# EAGLE design controller_ardu (EAGLE 7.2.0)
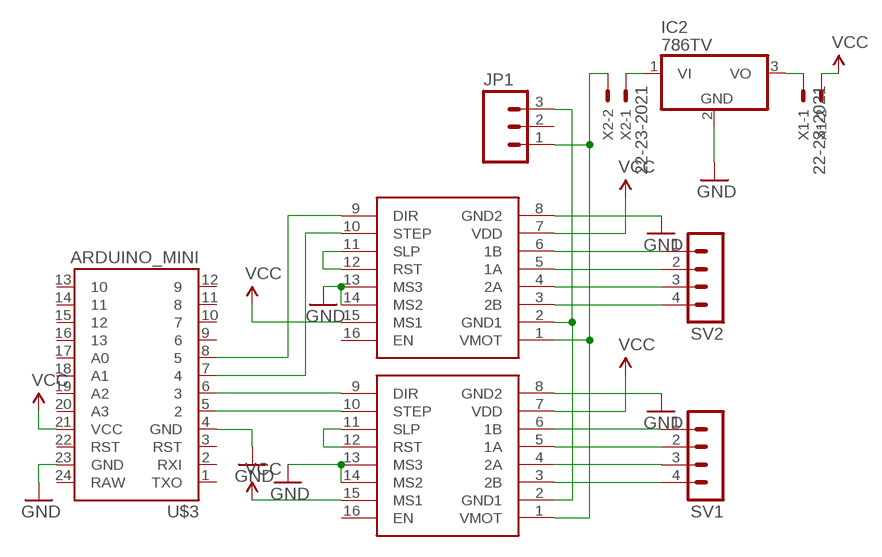
[diagram p0: schematic, sheet 1]

## Parts
IC2  786TV  [TO220V]
JP1  M03SCREW  [SCREWTERMINAL-3.5MM-3]
SV1  MA04-1  [MA04-1]
SV2  MA04-1  [MA04-1]
U$1  POLOLUESTEPPERDRIVER  [DIL16]
U$2  POLOLUESTEPPERDRIVER  [DIL16]
U$3  ARDUINO_MINI  [ARDUINO_MINI]
X1  22-23-2021  [22-23-2021]
X2  22-23-2021  [22-23-2021]

## Nets
GND: IC2.2(GND) U$1.8(GND2) U$1.13(MS3) U$1.14(MS2) U$2.8(GND2) U$2.13(MS3) U$2.14(MS2) U$3.4(GND) U$3.23(GND)
N$1: SV2.1 U$2.6(1B)
N$2: SV2.2 U$2.5(1A)
N$3: SV2.3 U$2.4(2A)
N$4: SV2.4 U$2.3(2B)
N$5: U$2.10(STEP) U$3.7
N$6: U$2.9(DIR) U$3.8
N$7: U$2.11(SLP) U$2.12(RST)
N$9: SV1.1 U$1.6(1B)
N$10: SV1.2 U$1.5(1A)
N$11: SV1.3 U$1.4(2A)
N$12: SV1.4 U$1.3(2B)
N$13: U$1.9(DIR) U$3.6
N$14: U$1.10(STEP) U$3.5
N$15: U$1.11(SLP) U$1.12(RST)
N$17: JP1.3 U$1.2(GND1) U$2.2(GND1)
N$18: JP1.1 U$1.1(VMOT) U$2.1(VMOT) X2.2
N$19: IC2.3(VO) X1.1
N$20: IC2.1(VI) X2.1
VCC: U$1.7(VDD) U$1.15(MS1) U$2.7(VDD) U$2.15(MS1) U$3.21(VCC) X1.2
Unconnected: JP1.2 U$1.16(EN) U$2.16(EN) U$3.1(TXO) U$3.2(RXI) U$3.3(RST) U$3.9 U$3.10 U$3.11 U$3.12 U$3.13 U$3.14 U$3.15 U$3.16 U$3.17(A0) U$3.18(A1) U$3.19(A2) U$3.20(A3) U$3.22(RST) U$3.24(RAW)

## Library data of the parts
IC2 = linear:78*: Positive VOLTAGE REGULATOR Source: http://cache.national.com/ds/LM/LM78L05.pdf http://www.fairchildsemi.com/ds/LM/LM7805.pdf
JP1 = SparkFun-Connectors:M03: Header 3 Standard 3-pin 0.1" header. Use with straight break away headers (SKU : PRT-00116), right angle break away headers (PRT-00553), swiss pins (PRT-00743), machine pins (PRT-00117), and female headers (PRT-00115). Molex polarized connector foot print use with SKU : PRT-08232 with associated crimp pins and housings.
SV1 SV2 = con-lstb:MA04-1: PIN HEADER; OC_FARNELL: unknown; OC_NEWARK: unknown
U$1 U$2 = reprap:POLOLUESTEPPERDRIVER: Pololu stepper driver based on the A4983.
U$3 = SparkFun-Boards:ARDUINO_MINI: Arduino Pro Mini footprint
X1 X2 = con-molex:22-23-2021: .100" (2.54mm) Center Header - 2 Pin; MF: MOLEX; MPN: 22-23-2021; OC_FARNELL: 1462926; OC_NEWARK: 25C3832

## Board
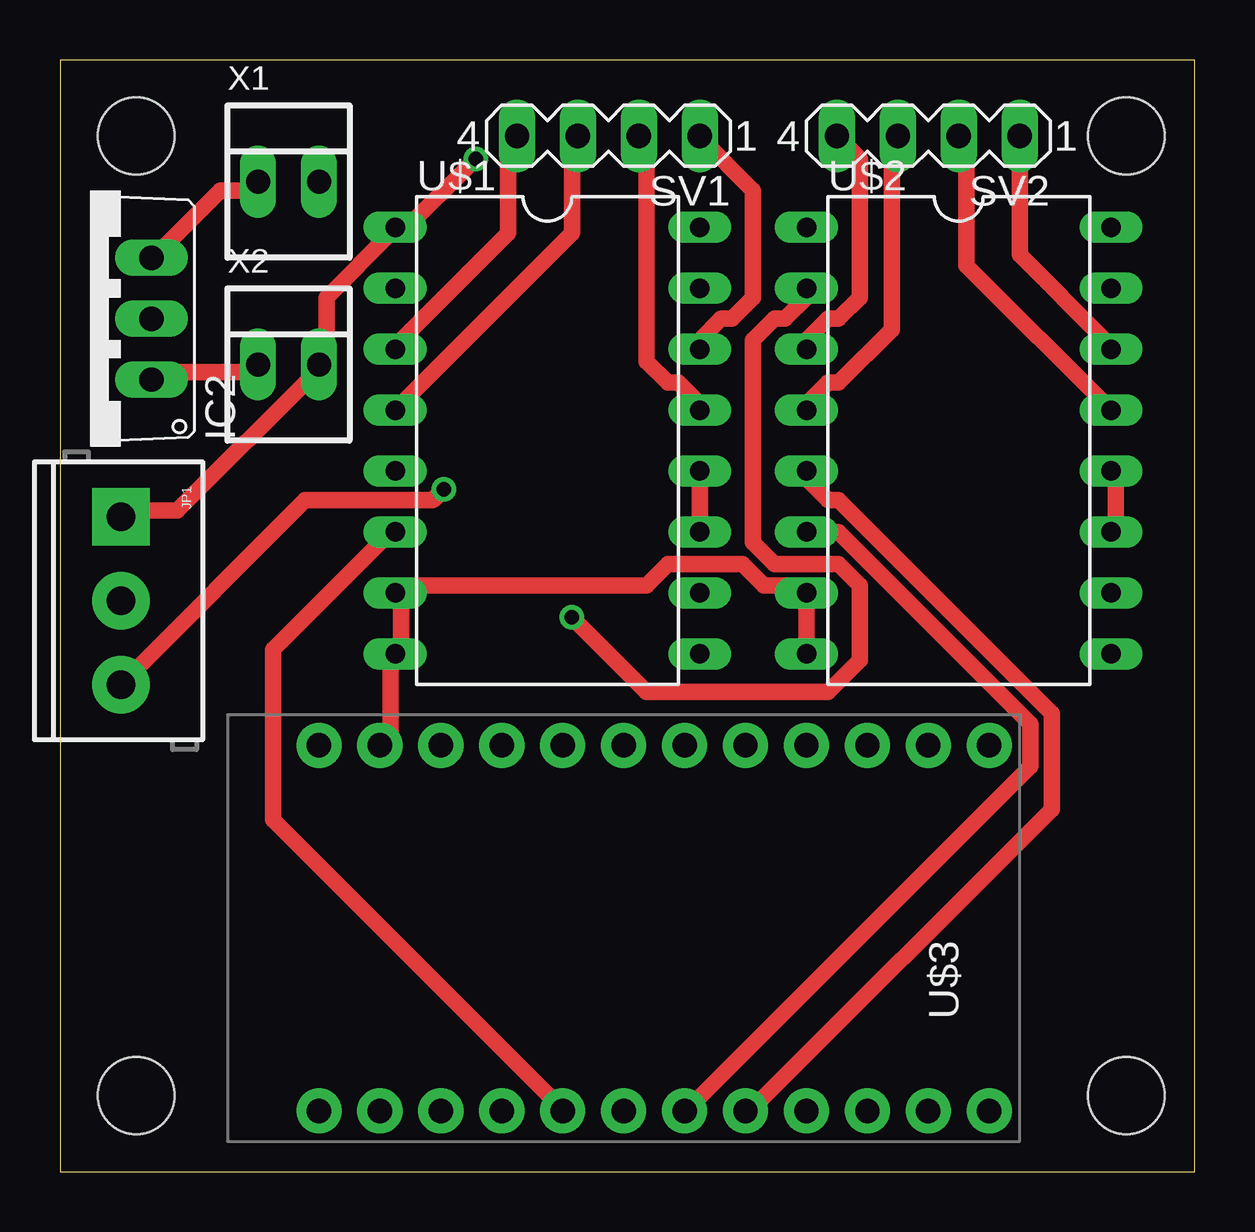
[diagram p1: board, top side]
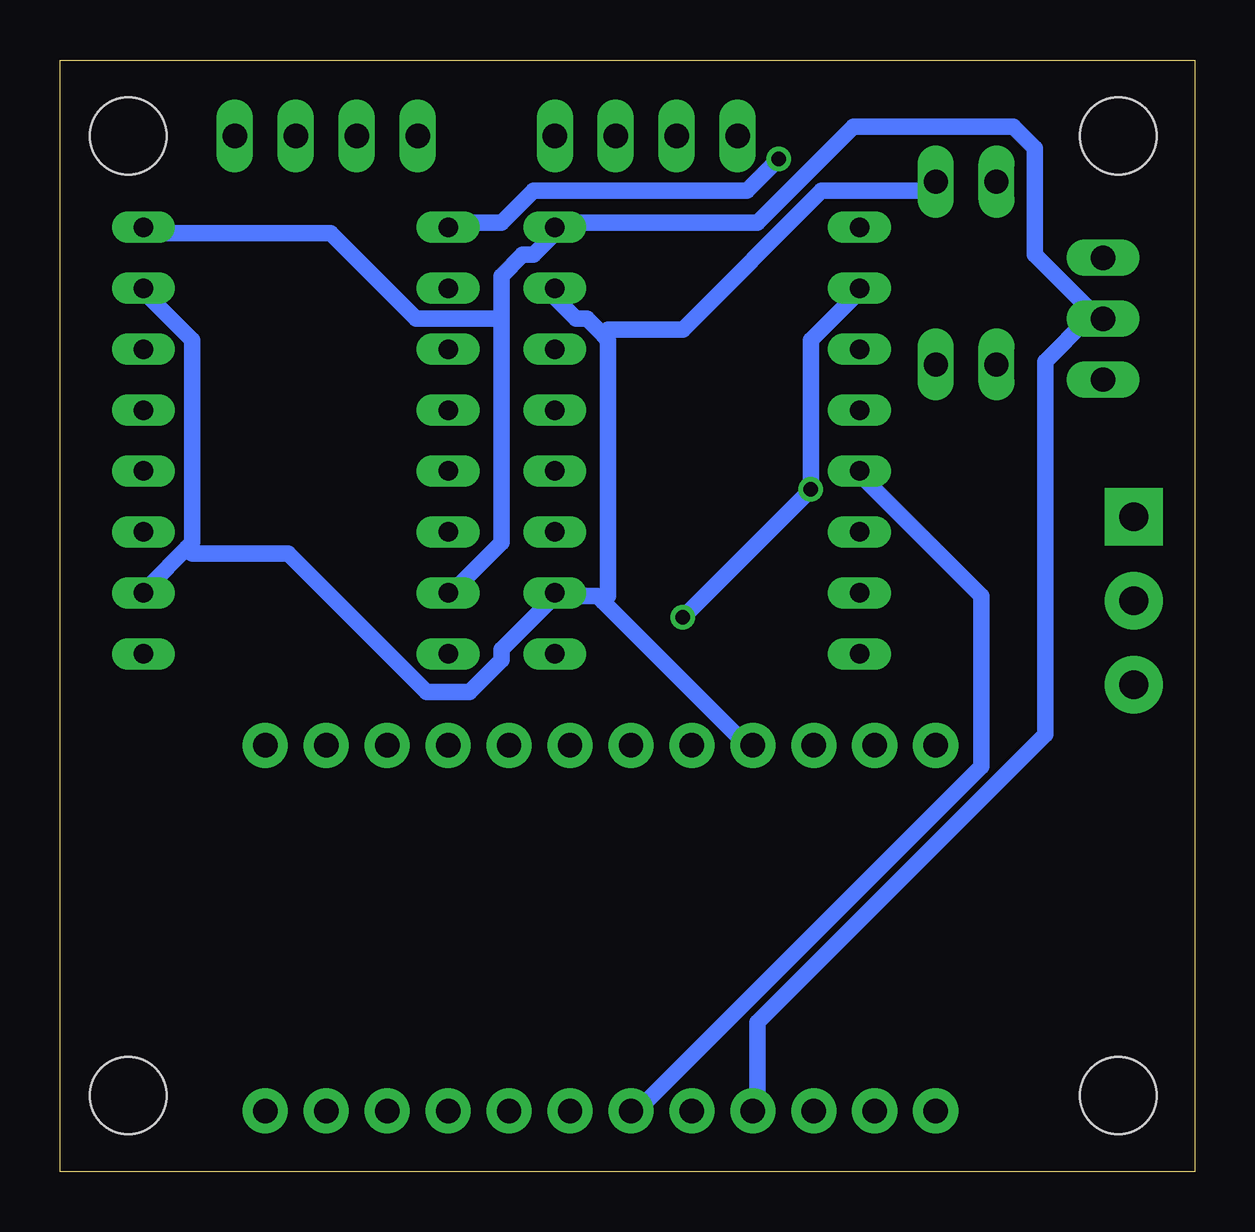
[diagram p2: board, bottom side, seen from below]

Size 47.3 x 46.34 mm. Coordinates in mm from the lower left corner, seen from the top.
Outline: 0,0 47.3,0 47.3,46.34 0,46.34 0,0
Copper layers (1*16): Top 0.035mm / dielectric 1.5mm / Bottom 0.035mm
Design rules "default *": minimum track width 27mil, minimum drill 24mil, track to track 8mil, track to pad 8mil, pad to pad 8mil, via to via 8mil, smd to smd 8mil, copper to edge 40mil, drill to drill 8mil, minimum pad ring 10mil, minimum via ring 8mil, stop-mask expansion 4mil, vias tented up to drill 0mil, thermal gap 10mil
Holes 3.2 mm at 3.17,43.18 44.45,43.18 44.45,3.17 3.17,3.17

### Footprints (pad centres in the part's own frame; a part is rotated, then mirrored left to right if it is on the bottom)
TO220V = drill 1.016 long: 1 -2.54,-2.54; 2 0,-2.54; 3 2.54,-2.54
SCREWTERMINAL-3.5MM-3 = drill 1.2 pad 2.413 square: 1 0,0 | drill 1.2 pad 2.413: 2 3.5,0; 3 7,0
MA04-1 = drill 1.016 long: 1 -3.81,0; 2 -1.27,0; 3 1.27,0; 4 3.81,0
DIL16 = drill 0.813 long: 1 -17.78,8.89; 2 -17.78,6.35; 3 -17.78,3.81; 4 -17.78,1.27; 5 -5.08,1.27; 6 -5.08,3.81; 7 -5.08,6.35; 8 -5.08,8.89; 9 -17.78,-1.27; 10 -17.78,-3.81; 11 -5.08,-3.81; 12 -5.08,-1.27; 13 -17.78,-6.35; 14 -17.78,-8.89; 15 -5.08,-6.35; 16 -5.08,-8.89
ARDUINO_MINI = drill 1.016 pad 1.88: 1 -7.62,12.7; 2 -7.62,10.16; 3 -7.62,7.62; 4 -7.62,5.08; 5 -7.62,2.54; 6 -7.62,0; 7 -7.62,-2.54; 8 -7.62,-5.08; 9 -7.62,-7.62; 10 -7.62,-10.16; 11 -7.62,-12.7; 12 -7.62,-15.24; 13 7.62,-15.24; 14 7.62,-12.7; 15 7.62,-10.16; 16 7.62,-7.62; 17 7.62,-5.08; 18 7.62,-2.54; 19 7.62,0; 20 7.62,2.54; 21 7.62,5.08; 22 7.62,7.62; 23 7.62,10.16; 24 7.62,12.7
22-23-2021 = drill 1 long: 1 -1.27,0; 2 1.27,0

### Placement (x,y rotation side)
IC2  1.27,35.56 90 top
JP1  2.54,27.3 270 top
SV1  22.86,43.18 180 top
SV2  36.2,43.18 180 top
U$1  31.75,30.48 0 top
U$2  48.9,30.48 0 top
U$3  23.5,10.16 90 top
X1  9.53,41.27 0 top
X2  9.53,33.66 0 top

### Tracks (layer width: path | path; a pad name or v marks a point on that pad's centre or on a via)
GND
  Top 0.686: U$3.23 13.78,18.22 13.78,21.34 U$1.14 14.22,21.78 14.22,24 U$1.13 14.22,24.45 24.45,24.45 25.34,25.34 28.45,25.34 29.34,24.45 31.11,24.45 U$2.13 U$2.14
  Bottom 0.686: 28.89,35.56 28.89,26.23 31.11,24 U$2.13 | 28.89,35.56 28.89,37.34 28,38.23 27.56,38.23 26.67,39.12 U$1.8 26.67,39.56 18.22,39.56 14.22,43.56 7.56,43.56 6.67,42.67 6.67,38.23 4,35.56 IC2.2 4.45,35.56 6.22,33.78 6.22,18.22 18.22,6.22 18.22,2.67 U$3.4 | 28.89,35.56 32.45,35.56 36.01,39.12 43.56,39.12 U$2.8
N$1
  Top 0.686: SV2.1 40.01,38.23 43.56,34.67 U$2.6
N$2
  Top 0.686: U$2.5 37.78,37.78 37.78,43.12 SV2.2
N$3
  Top 0.686: U$2.4 31.11,32 32,32.89 32.45,32.89 34.67,35.12 34.67,43.12 SV2.3
N$4
  Top 0.686: SV2.4 33.34,42.23 33.34,36.45 32.45,35.56 32,35.56 31.11,34.67 U$2.3
N$5
  Top 0.686: U$2.10 32.45,26.67 40.45,18.67 40.45,16.89 26.23,2.67 U$3.7
N$6
  Top 0.686: U$2.9 31.11,28.89 32,28 32.45,28 41.34,19.11 41.34,15.11 28.89,2.67 U$3.8
N$7
  Top 0.686: U$2.11 44.01,26.67 44.01,28.89 U$2.12
N$9
  Top 0.686: U$1.6 26.67,34.67 27.56,35.56 28,35.56 28.89,36.45 28.89,40.89 26.67,43.12 SV1.1
N$10
  Top 0.686: U$1.5 26.67,32 25.78,32.89 25.34,32.89 24.45,33.78 24.45,43.12 SV1.2
N$11
  Top 0.686: U$1.4 21.34,39.12 21.34,43.12 SV1.3
N$12
  Top 0.686: U$1.3 14.22,34.67 18.67,39.12 18.67,43.12 SV1.4
N$13
  Bottom 0.686: U$1.9 13.78,28.89 8.89,24 8.89,16.89 23.11,2.67 U$3.6
N$14
  Top 0.686: U$1.10 13.78,26.67 8.89,21.78 8.89,14.67 20.89,2.67 U$3.5
N$15
  Top 0.686: U$1.12 U$1.11
N$17  (via drill 0.61)
  Top 0.686: v16,28.45 15.56,28 10.22,28 2.67,20.45 JP1.3 | v21.34,23.11 24.45,20 32,20 33.34,21.34 33.34,24.45 32.45,25.34 29.78,25.34 28.89,26.23 28.89,34.67 29.78,35.56 30.23,35.56 31.11,36.45 U$2.2
  Bottom 0.686: U$1.2 14.22,36.45 16,34.67 v16,28.45 v21.34,23.11
N$18  (via drill 0.61)
  Top 0.686: v17.34,42.23 14.22,39.12 U$1.1 13.78,39.12 11.11,36.45 11.11,33.78 X2.2 10.67,33.34 4.89,27.56 2.67,27.56 JP1.1
  Bottom 0.686: v17.34,42.23 18.67,40.89 27.56,40.89 28.89,39.56 31.11,39.56 U$2.1
N$19
  Top 0.686: X1.1 8,40.89 6.67,40.89 4,38.23 IC2.3
N$20
  Top 0.686: X2.1 8,33.34 4,33.34 IC2.1
VCC
  Bottom 0.686: 42.01,26 41.78,26.23 41.78,34.67 43.56,36.45 U$2.7 | 42.01,26 43.56,24.45 U$2.15 | 26.67,24 24.89,24 24.67,23.78 | 24.67,23.78 18.67,17.78 U$3.21 | 24.67,34.89 24.45,34.67 24.45,24 24.67,23.78 | 24.67,34.89 25.34,35.56 25.78,35.56 26.67,36.45 U$1.7 | X1.2 11.11,40.89 15.56,40.89 21.34,35.12 24.45,35.12 24.67,34.89 | 26.67,24 28.89,21.78 28.89,21.34 30.23,20 32,20 37.78,25.78 41.78,25.78 42.01,26 | 26.67,24 U$1.15